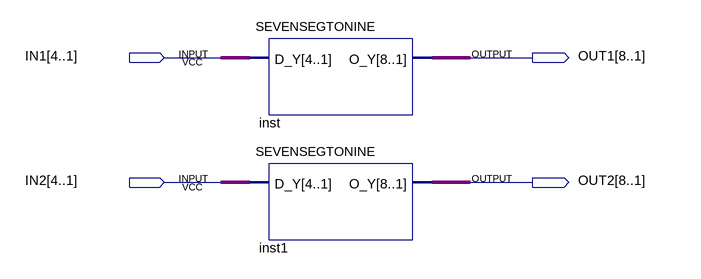
[diagram p0: schematic sheet]
// Quartus schematic Project4MAX.bdf as structural Verilog: 2 symbols, 4 pins
module Project4MAX (
  input  [4:1] IN1,
  input  [4:1] IN2,
  output [8:1] OUT1,
  output [8:1] OUT2
);

  SEVENSEGTONINE inst (.D_Y(IN1), .O_Y(OUT1));
  SEVENSEGTONINE inst1 (.D_Y(IN2), .O_Y(OUT2));
endmodule
